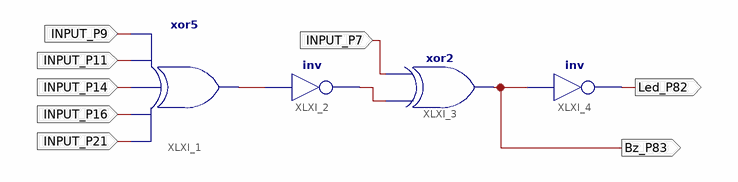
[diagram p0: schematic sheet 1]
// Xilinx ISE schematic Lab5_3R.sch (spartan6) as structural Verilog: 4 symbols, 8 ports
module Lab5_3R (
  input  INPUT_P9,
  input  INPUT_P11,
  input  INPUT_P14,
  input  INPUT_P16,
  input  INPUT_P21,
  input  INPUT_P7,
  output Bz_P83,
  output Led_P82
);

  wire XLXN_1, XLXN_2;

  xor XLXI_1 (XLXN_1, INPUT_P21, INPUT_P16, INPUT_P14, INPUT_P11, INPUT_P9);
  not XLXI_2 (XLXN_2, XLXN_1);
  xor XLXI_3 (Bz_P83, XLXN_2, INPUT_P7);
  not XLXI_4 (Led_P82, Bz_P83);
endmodule
